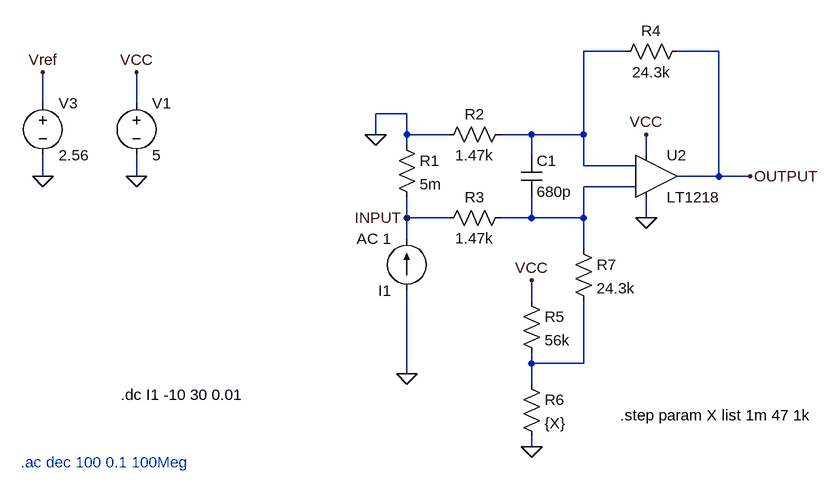
[diagram p0: schematic opamp.asc]
opamp.asc, the LTspice schematic file:
Version 4
SHEET 1 880 680
WIRE 208 -96 144 -96
WIRE 352 -96 288 -96
WIRE -688 -16 -688 -64
WIRE -544 -16 -544 -64
WIRE -128 0 -176 0
WIRE -176 32 -176 0
WIRE -128 32 -128 0
WIRE -64 32 -128 32
WIRE 64 32 16 32
WIRE 144 32 144 -96
WIRE 144 32 64 32
WIRE -128 48 -128 32
WIRE 64 64 64 32
WIRE 240 64 240 32
WIRE 144 80 144 32
WIRE 224 80 144 80
WIRE -688 96 -688 64
WIRE -544 96 -544 64
WIRE 352 96 352 -96
WIRE 352 96 288 96
WIRE 400 96 352 96
WIRE 224 112 144 112
WIRE -128 160 -128 128
WIRE -64 160 -128 160
WIRE 64 160 64 128
WIRE 64 160 16 160
WIRE 144 160 144 112
WIRE 144 160 64 160
WIRE 240 160 240 128
WIRE -128 192 -128 160
WIRE 144 208 144 160
WIRE 64 288 64 256
WIRE 64 384 64 368
WIRE 144 384 144 288
WIRE 144 384 64 384
WIRE -128 400 -128 272
WIRE 64 416 64 384
WIRE 64 512 64 496
FLAG -544 96 0
FLAG -544 -64 VCC
FLAG 240 32 VCC
FLAG 240 160 0
FLAG 64 512 0
FLAG 64 256 VCC
FLAG 400 96 OUTPUT
FLAG -128 160 INPUT
FLAG -128 400 0
FLAG -176 32 0
FLAG -688 96 0
FLAG -688 -64 Vref
SYMBOL voltage -544 -32 R0
SYMATTR InstName V1
SYMATTR Value 5
SYMBOL res -144 32 R0
SYMATTR InstName R1
SYMATTR Value 5m
SYMBOL current -128 272 R180
WINDOW 123 0 0 Left 0
WINDOW 39 0 0 Left 0
SYMATTR InstName I1
SYMATTR Value AC 1
SYMBOL res 32 16 R90
WINDOW 0 0 56 VBottom 2
WINDOW 3 32 56 VTop 2
SYMATTR InstName R2
SYMATTR Value 1.47k
SYMBOL res 32 144 R90
WINDOW 0 0 56 VBottom 2
WINDOW 3 32 56 VTop 2
SYMATTR InstName R3
SYMATTR Value 1.47k
SYMBOL res 304 -112 R90
WINDOW 0 0 56 VBottom 2
WINDOW 3 32 56 VTop 2
SYMATTR InstName R4
SYMATTR Value 24.3k
SYMBOL res 48 400 R0
SYMATTR InstName R6
SYMATTR Value {X}
SYMBOL res 128 192 R0
SYMATTR InstName R7
SYMATTR Value 24.3k
SYMBOL cap 48 64 R0
SYMATTR InstName C1
SYMATTR Value 680p
SYMBOL voltage -688 -32 R0
SYMATTR InstName V3
SYMATTR Value 2.56
SYMBOL Opamps\\LT1218 256 96 R0
SYMATTR InstName U2
SYMBOL res 48 272 R0
SYMATTR InstName R5
SYMATTR Value 56k
TEXT -568 432 Left 2 !.dc I1 -10 30 0.01
TEXT 200 464 Left 2 !.step param X list 1m 47 1k
TEXT -722 536 Left 2 ;.ac dec 100 0.1 100Meg

The netlist it stands for:
* opamp.asc
V1 VCC 0 5
R1 0 INPUT 5m
I1 0 INPUT AC 1
R2 N001 0 1.47k
R3 N002 INPUT 1.47k
R4 OUTPUT N001 24.3k
R6 N003 0 {X}
R7 N002 N003 24.3k
C1 N001 N002 680p
V3 Vref 0 2.56
XU2 N002 N001 VCC 0 OUTPUT NC_01 LT1218
R5 VCC N003 56k
.dc I1 -10 30 0.01
.step param X list 1m 47 1k
* .ac dec 100 0.1 100Meg
.lib LTC.lib
.backanno
.end